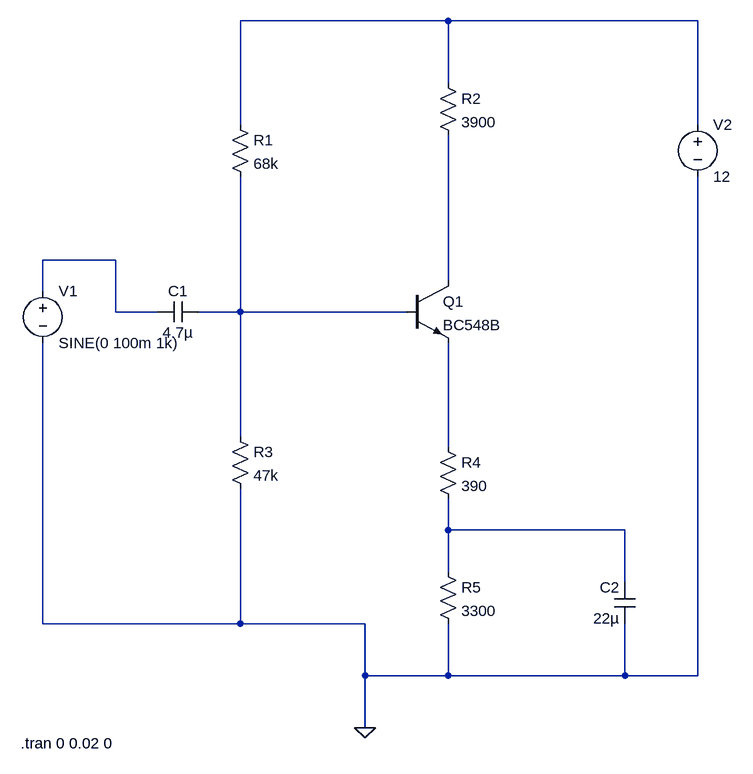
[diagram p0: schematic A03 - Simulacao.asc]
A03 - Simulacao.asc, the LTspice schematic file:
Version 4
SHEET 1 1224 712
WIRE 432 -416 112 -416
WIRE 816 -416 432 -416
WIRE 432 -320 432 -416
WIRE 112 -256 112 -416
WIRE 816 -256 816 -416
WIRE -80 -48 -192 -48
WIRE 432 -16 432 -240
WIRE -192 0 -192 -48
WIRE -80 32 -80 -48
WIRE -16 32 -80 32
WIRE 112 32 112 -176
WIRE 112 32 48 32
WIRE 368 32 112 32
WIRE 112 224 112 32
WIRE 432 240 432 80
WIRE 432 368 432 320
WIRE 704 368 432 368
WIRE 432 432 432 368
WIRE 704 448 704 368
WIRE -192 512 -192 80
WIRE 112 512 112 304
WIRE 112 512 -192 512
WIRE 304 512 112 512
WIRE 304 592 304 512
WIRE 432 592 432 512
WIRE 432 592 304 592
WIRE 704 592 704 512
WIRE 704 592 432 592
WIRE 816 592 816 -176
WIRE 816 592 704 592
WIRE 304 672 304 592
FLAG 304 672 0
SYMBOL voltage -192 -16 R0
WINDOW 123 0 0 Left 0
WINDOW 39 0 0 Left 0
SYMATTR InstName V1
SYMATTR Value SINE(0 100m 1k)
SYMBOL voltage 816 -272 R0
WINDOW 123 0 0 Left 0
WINDOW 39 0 0 Left 0
SYMATTR InstName V2
SYMATTR Value 12
SYMBOL npn 368 -16 R0
SYMATTR InstName Q1
SYMATTR Value BC548B
SYMBOL res 96 -272 R0
SYMATTR InstName R1
SYMATTR Value 68k
SYMBOL res 416 -336 R0
SYMATTR InstName R2
SYMATTR Value 3900
SYMBOL res 96 208 R0
SYMATTR InstName R3
SYMATTR Value 47k
SYMBOL res 416 224 R0
SYMATTR InstName R4
SYMATTR Value 390
SYMBOL res 416 416 R0
SYMATTR InstName R5
SYMATTR Value 3300
SYMBOL cap 48 16 R90
WINDOW 0 0 32 VBottom 2
WINDOW 3 32 32 VTop 2
SYMATTR InstName C1
SYMATTR Value 4.7µ
SYMBOL cap 720 512 R180
WINDOW 0 24 56 Left 2
WINDOW 3 24 8 Left 2
SYMATTR InstName C2
SYMATTR Value 22µ
TEXT -226 696 Left 2 !.tran 0 0.02 0

The netlist it stands for:
* A03 - Simulacao.asc
V1 N002 0 SINE(0 100m 1k)
V2 N001 0 12
Q1 N003 N004 N005 0 BC548B
R1 N001 N004 68k
R2 N001 N003 3900
R3 N004 0 47k
R4 N005 N006 390
R5 N006 0 3300
C1 N004 N002 4.7µ
C2 0 N006 22µ
.model NPN NPN
.model PNP PNP
.lib standard.bjt
.tran 0 0.02 0
.backanno
.end